# Altium schematic sheet ADC.SchDoc: ADC
size A4; DocumentNumber: 3; Revision: 2.0; SheetNumber: 3; SheetTotal: 18
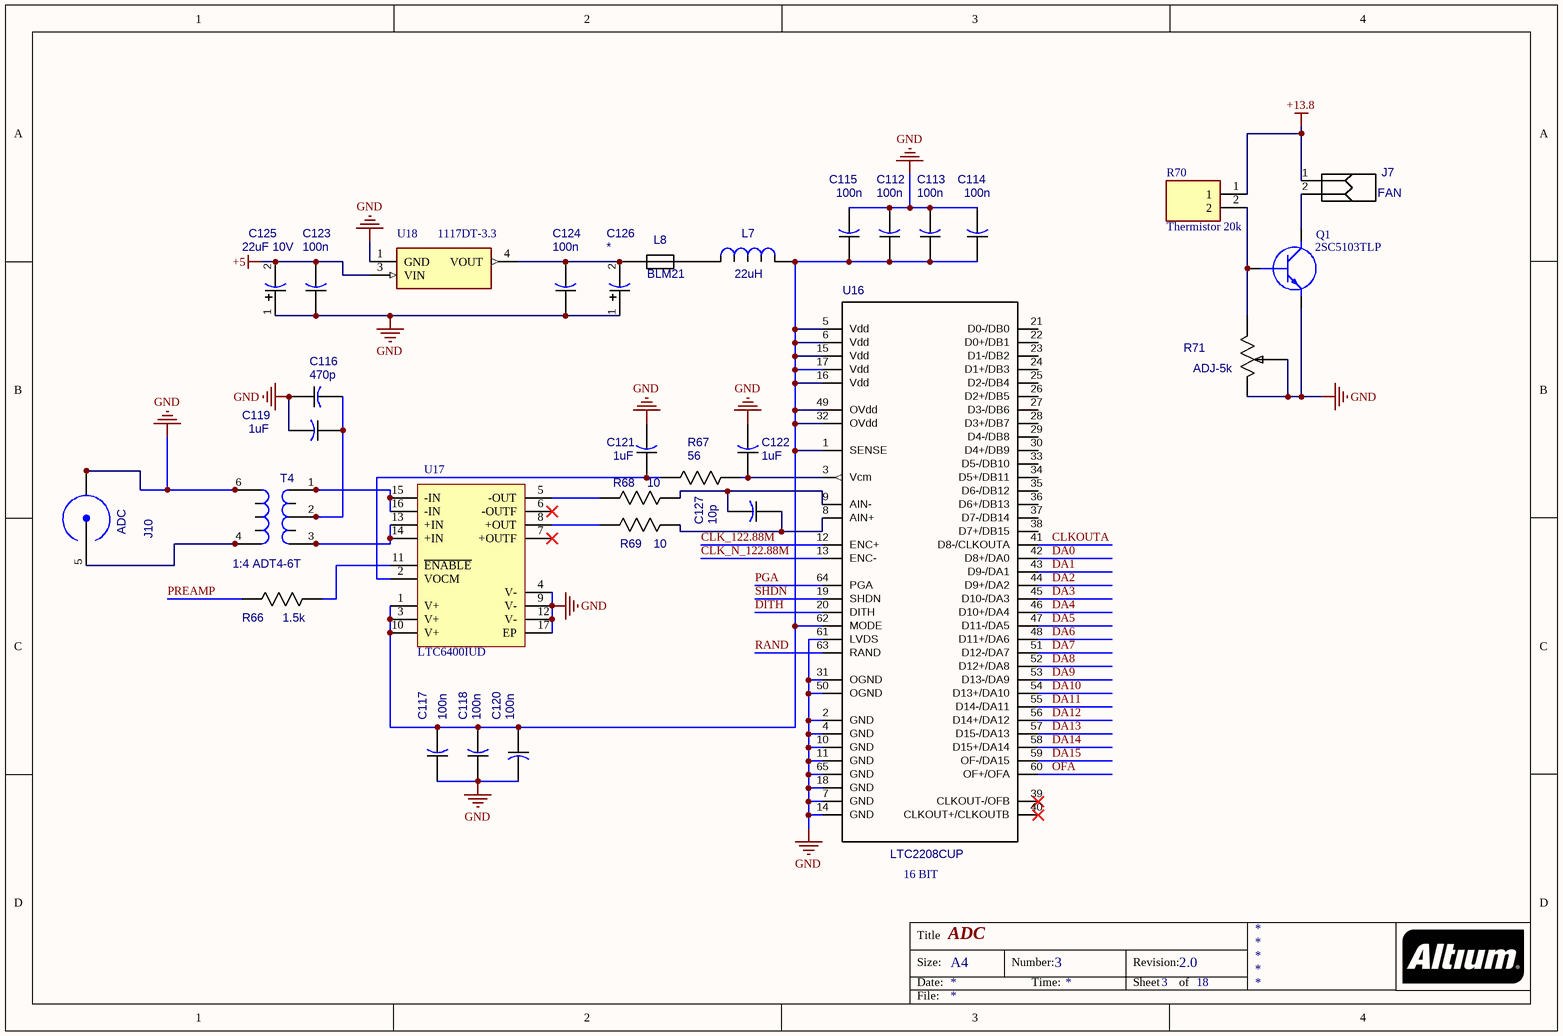
[diagram p0: ADC.SchDoc]

## Parts
C112  100n  [CAP_0805]
C113  100n  [CAP_0805]
C114  100n  [CAP_0805]
C115  100n  [CAP_0805]
C116  470p  [CAP_0805]
C117  100n  [CAP_0805]
C118  100n  [CAP_0805]
C119  1uF  [CAP_0805]
C120  100n  [CAP_0805]
C121  1uF  [CAP_0805]
C122  1uF  [CAP_0805]
C123  100n  [CAP_0805]
C124  100n  [CAP_0805]
C125  22uF 10V  [CAPAE_4.3x4.3h5.4]
C126  22uF 10V  [CAPAE_4.3x4.3h5.4]  (value not drawn)
C127  10p  [CAP_0805]
J7  FAN  [51022-0200]
J10  ADC  [31-5431]
L7  22uH  [CAPAE_6.6x6.6h5.4]
L8  BLM21  [CAP_0805]
Q1  2SC5103TLP  [2SC5103TLQ]
R66  1.5k  [RES_0805]
R67  56  [RES_0805]
R68  10  [RES_0603]
R69  10  [RES_0603]
R70  Thermistor 20k  [MF52A103F3950A1]
R71  ADJ-5k  [306J]
T4  1:4 ADT4-6T  [TRANSF_ACORE2]
U16  LTC2208CUP  [LTC2208CUP]
U17  LTC6400IUD  [LT-UD-16_N]
U18  1117DT-3.3  [TO228P991X238-3N]

## Nets
+5: C123.2 C125.2(MINUS) U18.3(VIN)
+13.8: J7.1 R70.1
GND: C112.2 C113.2 C114.2 C115.2 C116.1 C117.1 C118.1 C119.2 C120.2 C121.2 C122.2 C123.1 C124.1 C125.1(PLUS) C126.1(PLUS) J10.1(GND) J10.2(GND) J10.3(GND) J10.4(GND) Q1.3(E) R71.1(CCW) R71.2(W) T4.6(P2) T4.10 U16.2(GND) U16.4(GND) U16.7(GND) U16.10(GND) U16.11(GND) U16.14(GND) U16.18(GND) U16.31(OGND) U16.50(OGND) U16.61(LVDS) U16.65(GND) U17.4(V-) U17.9(V-) U17.12(V-) U17.17(EP) U18.1(GND)
CLK_122.88M: U16.12(ENC+)
CLK_N_122.88M: U16.13(ENC-)
CLKOUTA: U16.41(D8-/CLKOUTA)
DA0: U16.42(D8+/DA0)
DA1: U16.43(D9-/DA1)
DA2: U16.44(D9+/DA2)
DA3: U16.45(D10-/DA3)
DA4: U16.46(D10+/DA4)
DA5: U16.47(D11-/DA5)
DA6: U16.48(D11+/DA6)
DA7: U16.51(D12-/DA7)
DA8: U16.52(D12+/DA8)
DA9: U16.53(D13-/DA9)
DA10: U16.54(D13+/DA10)
DA11: U16.55(D14-/DA11)
DA12: U16.56(D14+/DA12)
DA13: U16.57(D15-/DA13)
DA14: U16.58(D15+/DA14)
DA15: U16.59(OF-/DA15)
DITH: U16.20(DITH)
OFA: U16.60(OF+/OFA)
PGA: U16.64(PGA)
PREAMP: R66.2
RAND: U16.63(RAND)
SHDN: U16.19(SHDN)
NetC112_1: C112.1 C113.1 C114.1 C115.1 C117.2 C118.2 C120.1 L7.2 U16.1(SENSE) U16.5(Vdd) U16.6(Vdd) U16.15(Vdd) U16.16(Vdd) U16.17(Vdd) U16.32(OVdd) U16.49(OVdd) U16.62(MODE) U17.1(V+) U17.3(V+) U17.10(V+)
NetC116_2: C116.2 C119.1 T4.2(S2) T4.8
NetC121_1: C121.1 R67.1 U17.2(VOCM)
NetC122_1: C122.1 R67.2 U16.3(Vcm)
NetC124_2: C124.2 C126.2(MINUS) L8.1 U18.4(VOUT)
NetC127_1: C127.1 R69.2 U16.8(AIN+)
NetC127_2: C127.2 R68.2 U16.9(AIN-)
NetJ7_2: J7.2 Q1.2(C)
NetJ10_5: J10.5(CON) T4.4(P1) T4.11
NetL7_1: L7.1 L8.2
NetQ1_1: Q1.1(B) R70.2 R71.3(CW)
NetR66_1: R66.1 U17.11(~{ENABLE})
NetR68_1: R68.1 U17.5(-OUT)
NetR69_1: R69.1 U17.8(+OUT)
NetT4_1: T4.1(S3) T4.7 U17.15(-IN) U17.16(-IN)
NetT4_3: T4.3(S1) T4.9 U17.13(+IN) U17.14(+IN)

Not connected (* = marked no-connect by the designer): U16 21(D0-/DB0) 22(D0+/DB1) 23(D1-/DB2) 24(D1+/DB3) 25(D2-/DB4) 26(D2+/DB5) 27(D3-/DB6) 28(D3+/DB7) 29(D4-/DB8) 30(D4+/DB9) 33(D5-/DB10) 34(D5+/DB11) 35(D6-/DB12) 36(D6+/DB13) 37(D7-/DB14) 38(D7+/DB15) 39(CLKOUT-/OFB)* 40(CLKOUT+/CLKOUTB)*; U17 6(-OUTF)* 7(+OUTF)*

## Notes on the sheet
- 16 BIT
- Title
- Size:
- Date:
- A4
- Number:
- Time:
- Revision:
- Sheet
- of
- File:

## Library data of the parts
C112-C124 C127 = CAP_0805
  C112-C115 C117 C118 C120 C123 C124: Value: 100n
  C116: Value: 470p
  C119 C121 C122: Value: 1uF
  C127: Value: 10p
C125 C126 = CAPAE_4.3x4.3h5.4: Value: *
J7 = 51022-0200
J10 = 31-5431: SMA; Value: ADC
L7 = IND_1206
L8 = IND_FERRITE_BEAD
Q1 = 2SC5103TLP: Transistor BJT NPN; Manufacturer_Name: ROHM Semiconductor; Datasheet Link: https://componentsearchengine.com/Datasheets/1/2SC5103TLP.pdf; Height: 2.5mm; Manufacturer_Part_Number: 2SC5103TLP; Mouser Part Number: 755-2SC5103TLP; Mouser Price/Stock: https://www.mouser.co.uk/ProductDetail/ROHM-Semiconductor/2SC5103TLP?qs=4kLU8WoGk0sDL0zMTtaqxg%3D%3D
R66 R67 = RES_0805
  R66: Value: 1.5k
  R67: Value: 56
R68 R69 = RES_0603: Value: 10
R70 = MF52A103F3950_A1_: Thermistor; Manufacturer_Name: Nanjing Shiheng Electronic Technology Co.; Manufacturer_Part_Number: MF52A103F3950(A1); Datasheet Link: https://datasheet.lcsc.com/szlcsc/Nanjing-Shiheng-Elec-MF52A1103F3950-P334-4_C13879.pdf; Height: 4mm
R71 = 306J
T4 = TRANSF_ACORE2: Transformer; Value: 1:4 ADT4-6T
U17 = CMP-0359-03855-2: Single Channel, Low Noise, Low Distortion Differential ADC Driver for 300 MHz IF, 1800 MHz Typical GBW, 4500 V/us Typical SR, 2.85 to 3.5 V, 16-Pin QFN (UD-16), Industrial, Pb-Free; Manufacturer: Linear Technology; Linear Technology Part Number: LTC6400-20; PartNumber: LTC6400IUD-20#PBF; Vs Min (V): 2.85; SR (V/us) Typical: 4500; Is (mA) Typical: 90; Vs Max (V): 3.5; Vos (mV) Typical: 2; GBW (MHz) Typical: 1800; Channels (#): 1; RoHS: Pb-Free; PackageReference: LT-UD-16; Type: DIFF; ComponentLink3Description: Package Specification; PackageDescription: 16-Lead Plastic QFN, Body 3.00 x 3.00 mm, Pitch 0.5 mm; ComponentLink1URL: http://www.linear.com/; Mounting Technology: Surface Mount; ComponentLink2URL: http://cds.linear.com/docs/en/datasheet/640020f.pdf; Code_JEDEC: MO-220; ComponentLink3URL: http://cds.linear.com/docs/en/packaging/QFN_16_05-08-1691.pdf; ComponentLink2Description: Datasheet; ComponentLink1Description: Manufacturer URL; RevisionNote: URLs updated
U18 = LM1117DT-ADJ: LD1117DT33 DPAK; Manufacturer_Name: Texas Instruments; Datasheet Link: http://www.ti.com/lit/ds/symlink/lm1117-n.pdf; Height: 2.38mm; Manufacturer_Part_Number: LM1117DT-ADJ; Mouser Part Number: 926-LM1117DT-ADJ; Mouser Price/Stock: https://www.mouser.com/Search/Refine.aspx?Keyword=926-LM1117DT-ADJ
U16 = LTC2208CUP: Value: LTC2208CUP